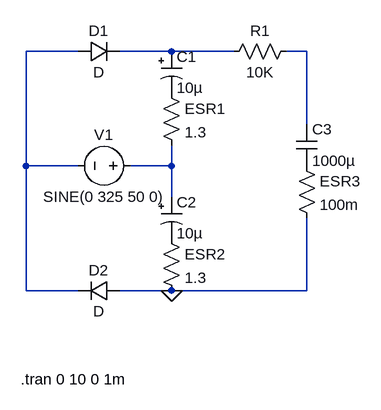
[diagram p0: schematic fullwave-doubler-1V00.asc]
fullwave-doubler-1V00.asc, the LTspice schematic file:
Version 4
SHEET 1 880 680
WIRE 96 -16 16 -16
WIRE 240 -16 160 -16
WIRE 336 -16 240 -16
WIRE 448 -16 416 -16
WIRE 448 96 448 -16
WIRE 16 160 16 -16
WIRE 96 160 16 160
WIRE 240 160 240 128
WIRE 240 160 176 160
WIRE 240 208 240 160
WIRE 16 352 16 160
WIRE 96 352 16 352
WIRE 240 352 160 352
WIRE 448 352 448 240
WIRE 448 352 240 352
FLAG 240 352 0
SYMBOL voltage 192 160 R90
WINDOW 0 -32 56 VBottom 2
WINDOW 3 32 56 VTop 2
WINDOW 123 0 0 Left 2
WINDOW 39 0 0 Left 2
SYMATTR InstName V1
SYMATTR Value SINE(0 325 50 0)
SYMBOL diode 96 0 R270
WINDOW 0 32 32 VTop 2
WINDOW 3 0 32 VBottom 2
SYMATTR InstName D1
SYMBOL diode 160 336 R90
WINDOW 0 0 32 VBottom 2
WINDOW 3 32 32 VTop 2
SYMATTR InstName D2
SYMBOL polcap 224 -16 R0
WINDOW 3 24 56 Left 2
SYMATTR Value 10µ
SYMATTR InstName C1
SYMATTR Description Capacitor
SYMATTR Type cap
SYMATTR SpiceLine V=450 Rser=0 Lser=0
SYMBOL cap 432 96 R0
SYMATTR InstName C3
SYMATTR Value 1000µ
SYMATTR SpiceLine V=450
SYMBOL res 224 32 R0
SYMATTR InstName ESR1
SYMATTR Value 1.3
SYMBOL polcap 224 208 R0
WINDOW 3 24 56 Left 2
SYMATTR Value 10µ
SYMATTR InstName C2
SYMATTR Description Capacitor
SYMATTR Type cap
SYMATTR SpiceLine V=450 Rser=0 Lser=0
SYMBOL res 224 256 R0
SYMATTR InstName ESR2
SYMATTR Value 1.3
SYMBOL res 432 144 R0
SYMATTR InstName ESR3
SYMATTR Value 100m
SYMBOL res 432 -32 R90
WINDOW 0 0 56 VBottom 2
WINDOW 3 32 56 VTop 2
SYMATTR InstName R1
SYMATTR Value 10K
TEXT 8 488 Left 2 !.tran 0 10 0 1m

The netlist it stands for:
* fullwave-doubler-1V00.asc
V1 N004 N001 SINE(0 325 50 0)
D1 N001 N002 D
D2 0 N001 D
C1 N002 P001 10µ V=450 Rser=0 Lser=0
C3 N003 P002 1000µ V=450
R§ESR1 P001 N004 1.3
C2 N004 P003 10µ V=450 Rser=0 Lser=0
R§ESR2 P003 0 1.3
R§ESR3 P002 0 100m
R1 N003 N002 10K
.model D D
.lib standard.dio
.tran 0 10 0 1m
.backanno
.end